# EAGLE schematic DebounceEncoder (EAGLE 7.4.1)
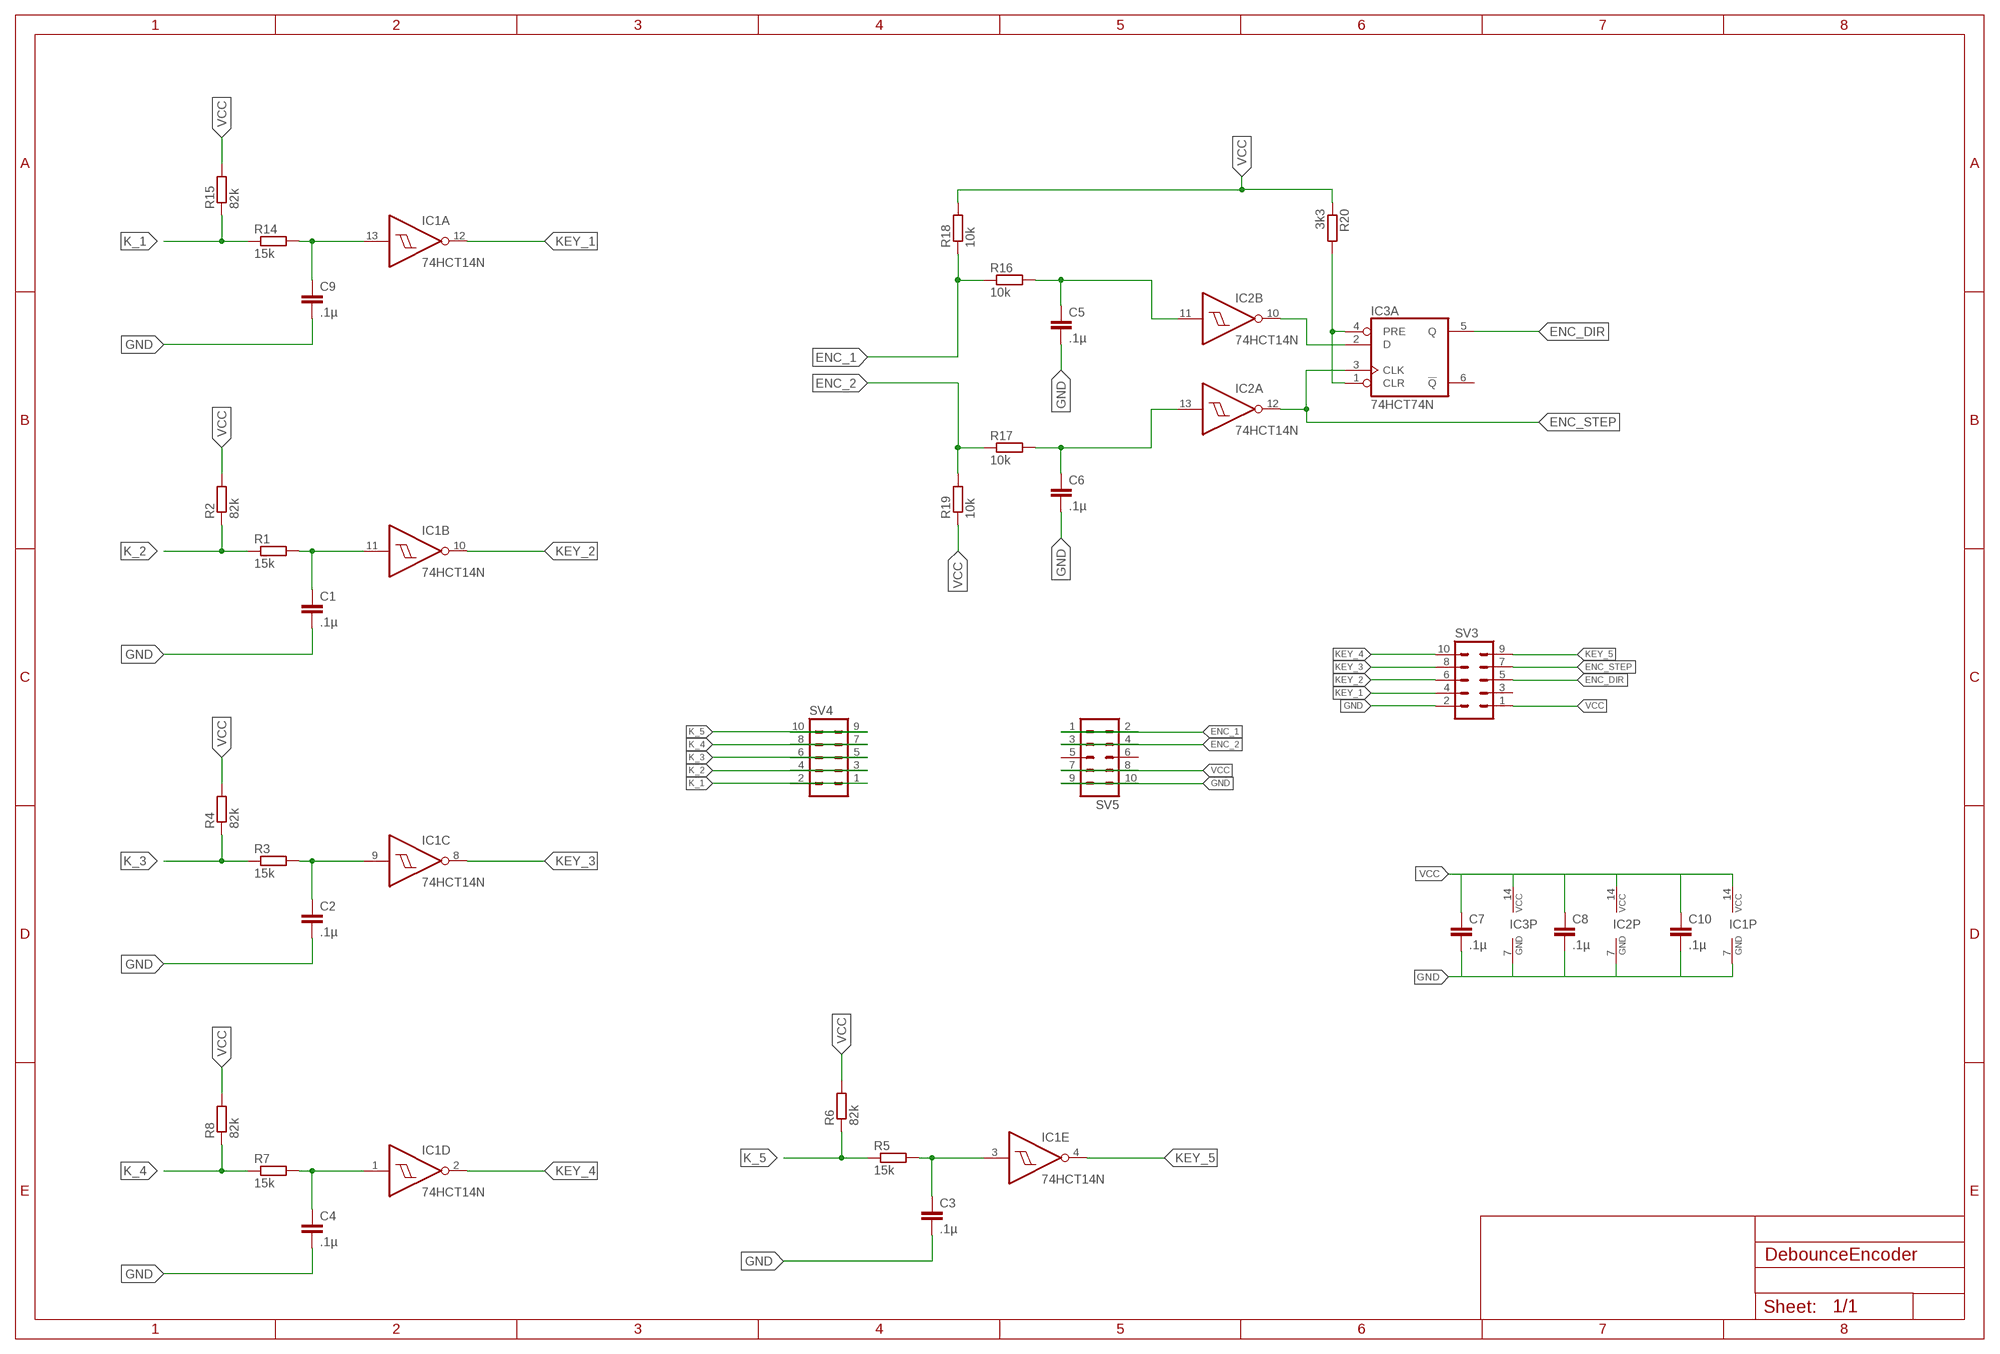
[diagram p0: schematic, sheet 1]

## Parts
C1  .1µ  C-EU025-024X044  [C025-024X044]
C2  .1µ  C-EU025-024X044  [C025-024X044]
C3  .1µ  C-EU025-024X044  [C025-024X044]
C4  .1µ  C-EU025-024X044  [C025-024X044]
C5  .1µ  C-EU025-024X044  [C025-024X044]
C6  .1µ  C-EU025-024X044  [C025-024X044]
C7  .1µ  C-EU025-024X044  [C025-024X044]
C8  .1µ  C-EU025-024X044  [C025-024X044]
C9  .1µ  C-EU025-024X044  [C025-024X044]
C10  .1µ  C-EU025-024X044  [C025-024X044]
IC1  74HCT14N  [DIL14]
IC2  74HCT14N  [DIL14]
IC3  74HCT74N  [DIL14]
R1  15k  R-EU_0204/7  [0204/7]
R2  82k  R-EU_0204/7  [0204/7]
R3  15k  R-EU_0204/7  [0204/7]
R4  82k  R-EU_0204/7  [0204/7]
R5  15k  R-EU_0204/7  [0204/7]
R6  82k  R-EU_0204/7  [0204/7]
R7  15k  R-EU_0204/7  [0204/7]
R8  82k  R-EU_0204/7  [0204/7]
R14  15k  R-EU_0204/7  [0204/7]
R15  82k  R-EU_0204/7  [0204/7]
R16  10k  R-EU_0204/7  [0204/7]
R17  10k  R-EU_0204/7  [0204/7]
R18  10k  R-EU_0204/7  [0204/7]
R19  10k  R-EU_0204/7  [0204/7]
R20  3k3  R-EU_0204/7  [0204/7]
SV3  ML10L  [ML10L]
SV4  MA05-2  [MA05-2]
SV5  MA05-2  [MA05-2]

## Nets
ENC1: C5.1 IC2.11(B:I) R16.2
ENC2: C6.1 IC2.13(A:I) R17.2
ENC_1: R16.1 R18.1 SV5.1 SV5.2
ENC_2: R17.1 R19.2 SV5.3 SV5.4
ENC_DIR: IC3.5(A:Q) SV3.5
ENC_STEP: IC2.12(A:O) IC3.3(A:CLK) SV3.7
GND [Supply]: C1.2 C2.2 C3.2 C4.2 C5.2 C6.2 C7.2 C8.2 C9.2 C10.2 IC1.7(P:GND) IC2.7(P:GND) IC3.7(P:GND) SV3.2 SV5.9 SV5.10
K1: C9.1 IC1.13(A:I) R14.2
K2: C1.1 IC1.11(B:I) R1.2
K3: C2.1 IC1.9(C:I) R3.2
K4: C3.1 IC1.3(E:I) R5.2
K5: C4.1 IC1.1(D:I) R7.2
K_1: R14.1 R15.1 SV4.1 SV4.2
K_2: R1.1 R2.1 SV4.3 SV4.4
K_3: R3.1 R4.1 SV4.5 SV4.6
K_4: R7.1 R8.1 SV4.7 SV4.8
K_5: R5.1 R6.1 SV4.9 SV4.10
KEY_1: IC1.12(A:O) SV3.4
KEY_2: IC1.10(B:O) SV3.6
KEY_3: IC1.8(C:O) SV3.8
KEY_4: IC1.2(D:O) SV3.10
KEY_5: IC1.4(E:O) SV3.9
N$1: IC2.10(B:O) IC3.2(A:D)
N$2: IC3.1(A:CLR) IC3.4(A:PRE) R20.2
VCC [Supply]: C7.1 C8.1 C10.1 IC1.14(P:VCC) IC2.14(P:VCC) IC3.14(P:VCC) R2.2 R4.2 R6.2 R8.2 R15.2 R18.2 R19.1 R20.1 SV3.1 SV5.7 SV5.8
Unconnected: IC1.5(F:I) IC1.6(F:O) IC2.1(D:I) IC2.2(D:O) IC2.3(E:I) IC2.4(E:O) IC2.5(F:I) IC2.6(F:O) IC2.8(C:O) IC2.9(C:I) IC3.6(A:!Q) IC3.8(B:!Q) IC3.9(B:Q) IC3.10(B:PRE) IC3.11(B:CLK) IC3.12(B:D) IC3.13(B:CLR) SV3.3 SV5.5 SV5.6

## Library data of the parts
C1-C10 = rcl:C-EU: CAPACITOR, European symbol
IC1 IC2 = 74xx-eu:74*14: Hex schmitt trigger INVERTER
IC3 = 74xx-eu:74*74: Dual D type positive edge triggered FLIP FLOP, preset and clear
R1-R8 R14-R20 = resistor:R-EU_: RESISTOR, European symbol
SV3 = con-harting-ml:ML10: HARTING; OC_FARNELL: unknown; OC_NEWARK: unknown
SV4 SV5 = con-lstb:MA05-2: PIN HEADER; OC_FARNELL: unknown; OC_NEWARK: unknown

## Net classes
1 Supply: width 0.762 mm